# EAGLE board nixie (EAGLE 6.2), part 1 of 2
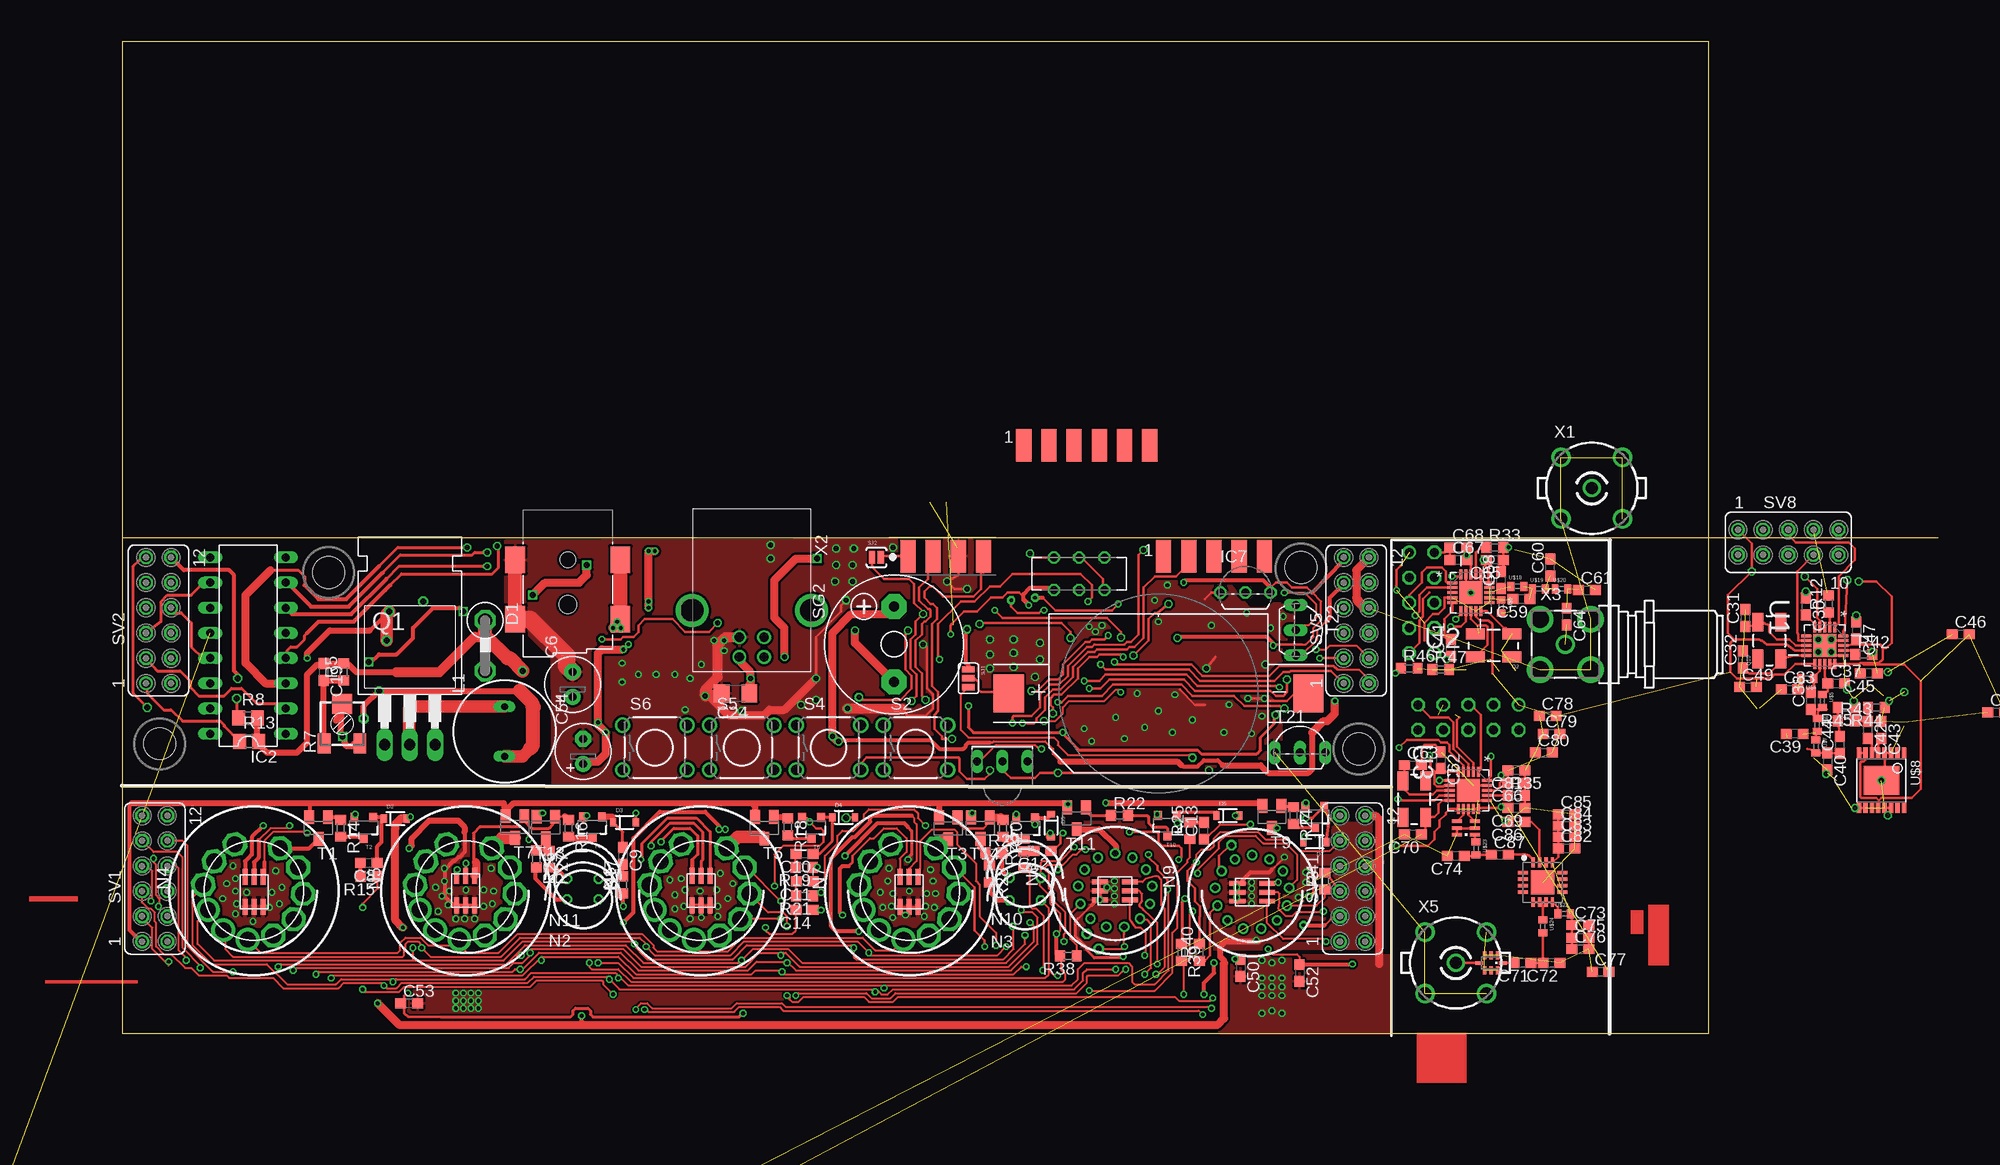
[diagram p5: board, top side]
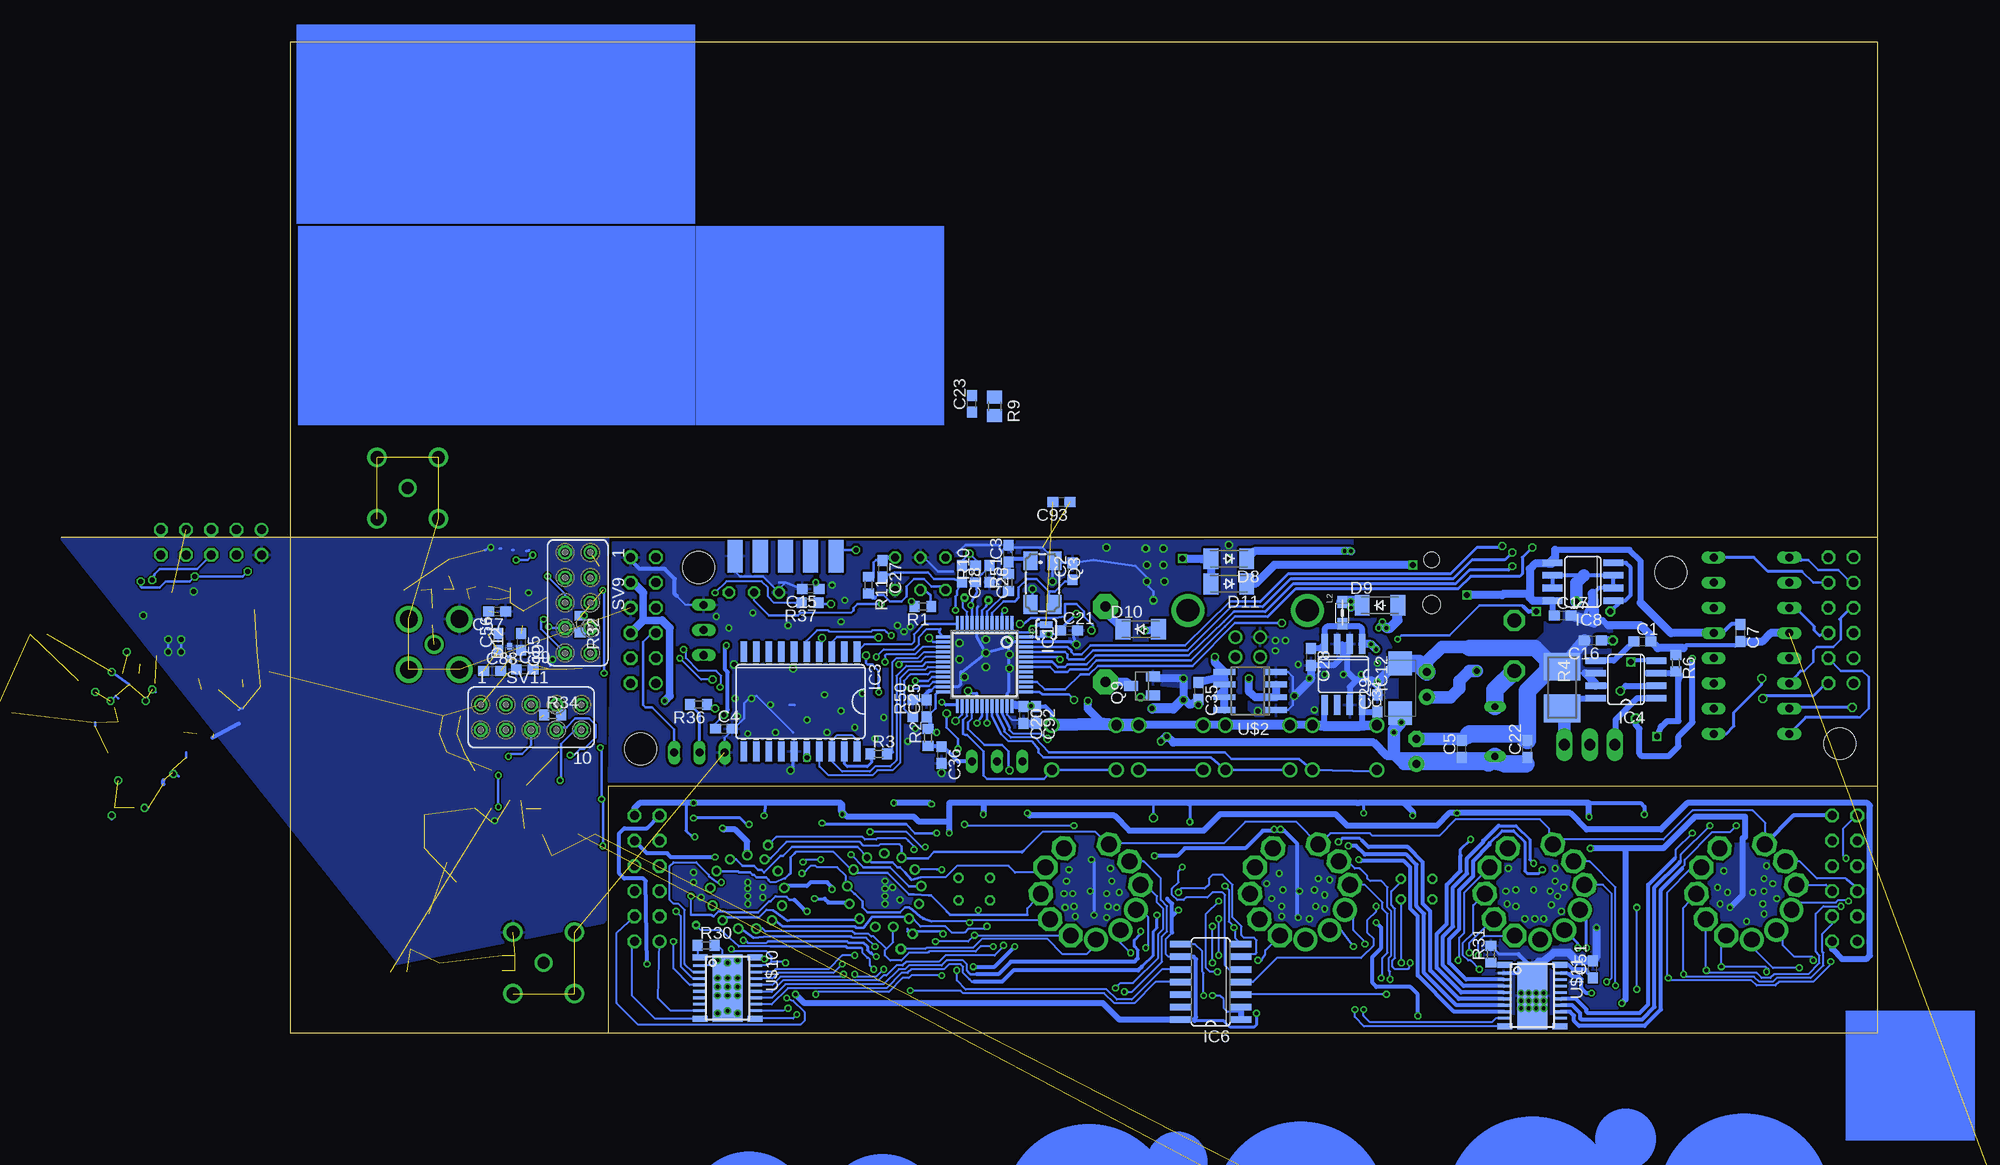
[diagram p6: board, bottom side, seen from below]

Size 183.15 x 100 mm. Coordinates in mm from the lower left corner, seen from the top.
Outline: 128.02,0 0,0 0,24.89
Outline: 128.02,0 160,0 160,100 0,100 0,50
Outline: 0,50 0,24.89
Outline: 0,50 183.15,50
Outline: 0,24.89 128.02,24.89 128.02,0
Copper layers (1*16): Top 0.035mm / dielectric 1.5mm / Bottom 0.035mm
Design rules: minimum track width 8mil, minimum drill 12mil, track to track 7mil, track to pad 7mil, pad to pad 6mil, via to via 7mil, smd to smd 0mil, copper to edge 0mil, drill to drill 10mil, minimum pad ring 8mil, minimum via ring 6mil, stop-mask expansion 2mil, vias tented up to drill 100mil, thermal gap 10mil
Holes 3.2 mm at 20.83,46.48 3.81,29.21 124.71,28.7 118.87,46.99

## Footprints (pad centres in the part's own frame; a part is rotated, then mirrored left to right if it is on the bottom)
COIN = smd 3.048 x 3.81: + -14.732,0.381; - 15.494,0.381
C0603 = smd 1.1 x 1: 1 -0.85,0; 2 0.85,0
E2,5-6 = drill 0.813 pad 1.6: + -1.27,0 | drill 0.813 pad 1.6 octagon: - 1.27,0
C1206 = smd 1.6 x 1.8: 1 -1.4,0; 2 1.4,0
SMC_C = smd 2.4 x 2.4: + -2.5,0; - 2.5,0
C1702-05 = drill 1.397 octagon: A 2.54,0; C -2.54,0
SOD-323 = smd 0.63 x 0.83: 1 -1.15,0; 2 1.15,0
SOD-123_MINI-SMA = smd 1.5 x 2.1: A 1.8,0; C -1.8,0
SOD523 = smd 0.7 x 0.5: A 0.7,0; C -0.6,0
SQFP-S-7X7-48 = smd 0.3 x 1.6: 1 -2.75,-4.1; 2 -2.25,-4.1; 3 -1.75,-4.1; 4 -1.25,-4.1; 5 -0.75,-4.1; 6 -0.25,-4.1; 7 0.25,-4.1; 8 0.75,-4.1; 9 1.25,-4.1; 10 1.75,-4.1; 11 2.25,-4.1; 12 2.75,-4.1; 25 2.75,4.1; 26 2.25,4.1; 27 1.75,4.1; 28 1.25,4.1; 29 0.75,4.1; 30 0.25,4.1; 31 -0.25,4.1; 32 -0.75,4.1; 33 -1.25,4.1; 34 -1.75,4.1; 35 -2.25,4.1; 36 -2.75,4.1 | smd 1.6 x 0.3: 13 4.1,-2.75; 14 4.1,-2.25; 15 4.1,-1.75; 16 4.1,-1.25; 17 4.1,-0.75; 18 4.1,-0.25; 19 4.1,0.25; 20 4.1,0.75; 21 4.1,1.25; 22 4.1,1.75; 23 4.1,2.25; 24 4.1,2.75; 37 -4.1,2.75; 38 -4.1,2.25; 39 -4.1,1.75; 40 -4.1,1.25; 41 -4.1,0.75; 42 -4.1,0.25; 43 -4.1,-0.25; 44 -4.1,-0.75; 45 -4.1,-1.25; 46 -4.1,-1.75; 47 -4.1,-2.25; 48 -4.1,-2.75
DIL16 = drill 0.813 long: 1 -8.89,-3.81; 2 -6.35,-3.81; 3 -3.81,-3.81; 4 -1.27,-3.81; 5 1.27,-3.81; 6 3.81,-3.81; 7 6.35,-3.81; 8 8.89,-3.81; 9 8.89,3.81; 10 6.35,3.81; 11 3.81,3.81; 12 1.27,3.81; 13 -1.27,3.81; 14 -3.81,3.81; 15 -6.35,3.81; 16 -8.89,3.81
SO20W = smd 0.66 x 2.032: 1 -5.715,-5.029; 2 -4.445,-5.029; 3 -3.175,-5.029; 4 -1.905,-5.029; 5 -0.635,-5.029; 6 0.635,-5.029; 7 1.905,-5.029; 8 3.175,-5.029; 9 4.445,-5.029; 10 5.715,-5.029; 11 5.715,5.029; 12 4.445,5.029; 13 3.175,5.029; 14 1.905,5.029; 15 0.635,5.029; 16 -0.635,5.029; 17 -1.905,5.029; 18 -3.175,5.029; 19 -4.445,5.029; 20 -5.715,5.029
SO08 = smd 0.66 x 2.032: 1 -1.905,-3.073; 2 -0.635,-3.073; 3 0.635,-3.073; 4 1.905,-3.073; 5 1.905,3.073; 6 0.635,3.073; 7 -0.635,3.073; 8 -1.905,3.073
SO14 = smd 0.66 x 2.032: 1 -3.81,-3.073; 2 -2.54,-3.073; 3 -1.27,-3.073; 4 0,-3.073; 5 1.27,-3.073; 6 2.54,-3.073; 7 3.81,-3.073; 8 3.81,3.073; 9 2.54,3.073; 10 1.27,3.073; 11 0,3.073; 12 -1.27,3.073; 13 -2.54,3.073; 14 -3.81,3.073
TO92- = drill 0.813 octagon: 1 -2.54,0; 2 0,0; 3 2.54,0
SMD_JACK = smd 2.7 x 2: 1 7,-4.8; 2 1,-4.8; 3 7,5.8; 3_1 1,5.8 | hole 1.6: 1,0.5 | hole 1.8: 5.5,0.5
BS11 = drill 0.7 long: 1 -2.5,0; 2 2.5,0
0805 = smd 1.2 x 1: 1 -1.1,0; 2 1.1,0
IN-3 = drill 0.6 octagon: A -1.587,0; K 1.587,0
IN-8 = drill 1.6 pad 2.2 octagon: 0 -4.46,-2.348; 1 1.926,-4.678; 2 4.011,-2.962; 3 5.111,-0.604; 7 -1.928,4.519; 9 -4.948,0.294; A -2.626,-4.297 | drill 1.6 pad 2.1: 4 4.636,1.915 | drill 1.6 pad 2.2: 5 3.089,3.966; 6 0.632,4.918 | drill 1.6 pad 2.1 octagon: 8 -4.008,2.862
IN-16 = drill 0.63: 0 -1.745,-3.325; 1 1.745,-3.325; 2 -2.49,2.81; 3 3.727,-0.453; 4 2.49,2.81; 5 0.898,3.645; 6 -0.898,3.645; 7 3.09,-2.133; 8 -3.727,-0.453; 9 -3.09,-2.133; A 0,-3.755; LHDP -3.511,1.331; RHDP 3.511,1.331
TO220BH = drill 1.118 long: D 0,-6.35; G -2.54,-6.35; S 2.54,-6.35
CRYSTAL-SMD-5X3 = smd 1.9 x 1.1: 1 -1.85,-1.15; 2 1.85,-1.15; 3 1.85,1.15; 4 -1.85,1.15
CTS406 = smd 1.9 x 1.4: 1 -2.2,-1.2; 2 2.2,-1.2; 3 2.2,1.2; 4 -2.2,1.2
SOT23 = smd 1 x 1.4: 1 -0.95,-1.1; 2 0.95,-1.1; 3 0,1.1
R0603 = smd 1 x 1.1: 1 -0.85,0; 2 0.85,0
SMS-WAV = smd 2.8 x 3.7: 1 2.108,0; 2 -2.108,0
RTRIM3314J = smd 1.3 x 2: 1 -1.8,-2; 3 1.8,-2 | smd 2 x 2: 2 0,2
R0805 = smd 1.3 x 1.5: 1 -0.95,0; 2 0.95,0
TACTILE-PTH = drill 1.016: 1 -3.251,2.261; 2 3.251,2.261; 3 -3.251,-2.261; 4 3.251,-2.261
F/CM12P = drill 1.016 pad 2.54 octagon: + 3.81,0; - -3.81,0
SJ_3 = smd 0.635 x 1.27: 1 -0.889,0; 2 0,0; 3 0.889,0
SJ_2S-NO = smd 0.635 x 1.27: 1 -0.45,0; 2 0.45,0
FE06-2 = drill 0.914: 1 -6.35,1.27 | drill 0.914 octagon: 2 -6.35,-1.27; 3 -3.81,1.27; 4 -3.81,-1.27; 5 -1.27,1.27; 6 -1.27,-1.27; 7 1.27,1.27; 8 1.27,-1.27; 9 3.81,1.27; 10 3.81,-1.27; 11 6.35,1.27; 12 6.35,-1.27
EDGE_10 = smd 1.524 x 3.302: 1 -7.62,-1.778; 3 -5.08,-1.778; 5 -2.54,-1.778; 7 0,-1.778; 9 2.54,-1.778 | smd 1.524 x 3.302 bottom: 2 -7.62,-1.778; 4 -5.08,-1.778; 6 -2.54,-1.778; 8 0,-1.778; 10 2.54,-1.778
EDGE_6 = smd 1.524 x 3.302: 1 -5.08,-1.778; 2 -2.54,-1.778; 3 0,-1.778; 4 2.54,-1.778; 5 5.08,-1.778; 6 7.62,-1.778
EDGE_4 = smd 1.524 x 3.302: 1 -3.81,0; 2 -1.27,0; 3 1.27,0; 4 3.81,0
FE05-2 = drill 0.914: 1 -5.08,1.27 | drill 0.914 octagon: 2 -5.08,-1.27; 3 -2.54,1.27; 4 -2.54,-1.27; 5 0,1.27; 6 0,-1.27; 7 2.54,1.27; 8 2.54,-1.27; 9 5.08,1.27; 10 5.08,-1.27
SOT23-BEC = smd 1 x 1.4: B -0.95,-1.1; C 0,1.1; E 0.95,-1.1
SOT23-3 = smd 0.8 x 0.9: 1 -0.95,-1; 2 0.95,-1; 3 0,1.1
TO92-EBC = drill 0.813 long: B 0,-1.27; C 2.54,-1.27; E -2.54,-1.27
QFN50P400X400X90-21N = smd 1.016 x 0.305: 1 -1.854,0.991; 2 -1.854,0.508; 3 -1.854,0; 4 -1.854,-0.508; 5 -1.854,-0.991; 11 1.854,-0.991; 12 1.854,-0.508; 13 1.854,0; 14 1.854,0.508; 15 1.854,0.991 | smd 0.305 x 1.016: 6 -0.991,-1.854; 7 -0.508,-1.854; 8 0,-1.854; 9 0.508,-1.854; 10 0.991,-1.854; 16 0.991,1.854; 17 0.508,1.854; 18 0,1.854; 19 -0.508,1.854; 20 -0.991,1.854 | smd 2.311 x 2.311: 21 0,0
IRREC = drill 0.8 long: 1 -2.54,0; 2 0,0; 3 2.54,0
SO-08 = smd 0.6 x 2.2: 1 -1.905,-2.6; 2 -0.635,-2.6; 3 0.635,-2.6; 4 1.905,-2.6; 5 1.905,2.6; 6 0.635,2.6; 7 -0.635,2.6; 8 -1.905,2.6
DPDTSLIDE = drill 0.8 octagon: 1A -2.54,0; 1B 2.54,0; 1X 0,0; 2A -2.54,3.3; 2B 2.54,3.3; 2X 0,3.3
C0402 = smd 0.7 x 0.9: 1 -0.65,0; 2 0.65,0
TSSOP16EXP = smd 0.45 x 1.05: 1 -2.275,-2.768; 2 -1.625,-2.768; 3 -0.975,-2.768; 4 -0.325,-2.768; 5 0.325,-2.768; 6 0.975,-2.768; 7 1.625,-2.768; 8 2.275,-2.768; 9 2.275,2.768; 10 1.625,2.768; 11 0.975,2.768; 12 0.325,2.768; 13 -0.325,2.768; 14 -0.975,2.768; 15 -1.625,2.768; 16 -2.275,2.768 | smd 3.58 x 2.94: EXP 0,0
HTSSOP20PWP = smd 0.61 x 1.5: 1 -3.095,-2.76; 10 3.095,-2.76; 11 3.095,2.76; 20 -3.095,2.76 | smd 0.27 x 1.2: 2 -2.275,-2.9; 3 -1.625,-2.9; 4 -0.975,-2.9; 5 -0.325,-2.9; 6 0.325,-2.9; 7 0.975,-2.9; 8 1.625,-2.9; 9 2.275,-2.9; 12 2.275,2.9; 13 1.625,2.9; 14 0.975,2.9; 15 0.325,2.9; 16 -0.325,2.9; 17 -0.975,2.9; 18 -1.625,2.9; 19 -2.275,2.9 | smd 6.8 x 3: EXP 0,0
PLCC6 = smd 1.6 x 0.5: 1 -1.3,0.5; 2 -1.3,-0.4; 3 -1.3,-1.3; 4 1.7,-1.3; 5 1.7,-0.4; 6 1.7,0.5
LFCSP_VQ_16 = smd 1 x 0.35: 1 2,0.975; 2 2,0.325; 3 2,-0.325; 4 2,-0.975; 9 -2,-0.975; 10 -2,-0.325; 11 -2,0.325; 12 -2,0.975 | smd 0.35 x 1: 5 0.975,-2; 6 0.325,-2; 7 -0.325,-2; 8 -0.975,-2; 13 -0.975,2; 14 -0.325,2; 15 0.325,2; 16 0.975,2 | smd 2.4 x 2.4: P$1 0,0
B35N61 = drill 1.2: 1 0,0 | drill 1.3: 2 3.099,3.099; 3 -3.099,3.099; 4 -3.099,-3.099; 5 3.099,-3.099
85-32004-10X = drill 0.92 pad 1.27: 1 4.71,-1.25; 2 4.71,1.25; 3 2.71,1.25; 4 2.71,-1.25 | drill 2.3 pad 3: M1 0,6.02; M2 0,-6.02
BU-SMA-G = drill 1.27: 1 0,0 | drill 1.778: 2 -2.55,2.55; 3 2.55,2.55; 4 2.55,-2.55; 5 -2.55,-2.55
LFL21_TC = smd 0.35 x 0.8: 1 -0.65,0.75; 2 0,0.75; 3 0.65,0.75; 5 0.65,-0.75; 6 0,-0.75; 7 -0.65,-0.75 | smd 0.8 x 0.35: 4 1.2,0; 8 -1.2,0
0896BM15A0001 = smd 0.35 x 1: 1 0.65,0.9; 2 0,0.9; 3 -0.7,0.9; 4 -0.7,-0.9; 5 0,-0.9; 6 0.65,-0.9

## Placement (x,y rotation side)
BAT1  [COIN]  104.14,33.91 0 top
C1  [C0603]  23.7,39.55 0 bottom
C2  [C0603]  81.15,46.61 90 bottom
C3  [C0603]  87.63,48.39 90 bottom
C4  [C0603]  116.33,30.73 0 bottom
C5  [C0603]  41.91,28.7 90 bottom
C6  [E2,5-6]  45.43,35.21 90 top
C7  [C0603]  13.84,40.39 270 bottom
C8  [C0603]  24.89,17.19 180 top
C9  [C0603]  50.5,17.91 270 top
C10  [C0603]  68.83,18.11 180 top
C11  [C0603]  68.84,15.32 180 top
C12  [C0603]  92.84,18.41 180 top
C13  [C0603]  109.09,20.45 90 top
C14  [C0603]  68.82,12.45 180 top
C15  [C0603]  107.57,44.83 180 bottom
C16  [C0603]  28.7,39.62 180 bottom
C17  [C0603]  31.75,42.16 0 bottom
C18  [C0603]  92.33,46.35 270 bottom
C19  [C0603]  20.32,36.45 270 top
C20  [C0603]  86.11,32.13 270 bottom
C21  [C0603]  81.53,40.64 0 bottom
C22  [C0603]  35.31,28.7 90 bottom
C23  [C0603]  91.31,63.5 90 bottom
C24  [C1206]  61.85,34.29 180 top
C25  [C0603]  95.89,32.77 90 bottom
C26  [C0603]  89.53,46.35 270 bottom
C27  [C0603]  100.33,46.86 270 bottom
C28  [C0603]  57.15,37.97 270 bottom
C29  [C0603]  50.42,33.27 90 bottom
C30  [C0603]  169.8,43.05 270 top
C31  [C0603]  163.7,41.91 90 top
C32  [C0603]  163.45,37.72 90 top
C33  [C0603]  168.15,34.67 0 top
C34  [SMC_C]  48.13,34.8 90 bottom
C35  [C0603]  68.45,34.54 270 bottom
C36  [C0603]  94.36,28.07 270 bottom
C37  [C0603]  172.85,35.31 0 top
C38  [C0603]  170.31,33.53 90 top
C39  [C0603]  168.66,30.23 180 top
C40  [C0603]  171.96,27.43 270 top
C41  [C0603]  133.99,38.86 90 top
C42  [C0603]  176.02,30.61 270 top
C43  [C0603]  177.42,30.61 270 top
C44  [C0603]  173.23,29.08 90 top
C45  [C0603]  176.15,36.32 180 top
C46  [C0603]  185.42,40.26 0 top
C47  [C0603]  174.88,40.64 270 top
C48  [C0603]  188.98,32.38 0 top  (outside the outline)
C49  [C0603]  163.96,34.92 0 top
C50  [C0603]  112.78,6.6 270 top
C51  [C0603]  28.7,6.48 90 bottom
C52  [C0603]  118.75,6.1 270 top
C53  [C0603]  28.96,3.05 0 top
C54  [E2,5-6]  46.48,28.45 90 top
C55  [C0603]  136.78,39.5 270 bottom
C56  [C0603]  139.06,39.5 90 bottom
C57  [C0603]  139.19,42.55 180 bottom
C58  [C0603]  139.06,45.72 90 top
C59  [C0603]  141.1,43.81 180 top
C60  [C0603]  144.02,46.99 90 top
C61  [C0603]  147.7,44.7 0 top
C62  [C0603]  132.97,27.56 270 top
C63  [C0603]  130.18,27.05 0 top
C64  [C0603]  145.67,42.04 270 top
C65  [C0603]  138.43,47.75 180 top
C66  [C0603]  140.59,25.27 180 top
C67  [C0603]  134.75,47.75 0 top
C68  [C0603]  134.75,49.02 0 top
C69  [C0603]  140.59,22.73 180 top
C70  [C0603]  130.18,20.07 180 top
C71  [C0603]  141.22,7.11 180 top
C72  [C0603]  144.15,7.11 180 top
C73  [C0603]  147.07,10.92 0 top
C74  [C0603]  134.49,17.91 180 top
C75  [C0603]  147.07,9.65 0 top
C76  [C0603]  147.07,8.51 0 top
C77  [C0603]  149.1,6.22 0 top
C78  [C0603]  143.76,32 0 top
C79  [C0603]  144.15,30.23 0 top
C80  [C0603]  143.38,28.32 0 top
C81  [C0603]  140.59,26.54 180 top
C82  [C0603]  145.67,18.67 0 top
C83  [C0603]  145.67,19.81 0 top
C84  [C0603]  145.67,20.95 0 top
C85  [C0603]  145.67,22.1 0 top
C86  [C0603]  140.59,21.34 180 top
C87  [C0603]  138.94,18.03 0 top
C88  [C0603]  139.7,36.58 0 bottom
C89  [C0603]  136.4,36.7 0 bottom
C90  [C0603]  -44.45,-73.66 0 top  (outside the outline)
C91  [C0603]  -44.45,-77.72 0 top  (outside the outline)
C92  [C0603]  84.84,32.13 270 bottom
C93  [C0603]  82.3,53.59 180 bottom
D1  1N5059  [C1702-05]  36.62,39.1 270 top
D2  CGRM4001-G  [SOD-323]  27.56,21.67 0 top
D3  CGRM4001-G  [SOD-323]  50.67,21.29 0 top
D4  CGRM4001-G  [SOD-323]  72.77,21.8 0 top
D5  CGRM4001-G  [SOD-323]  93.68,20.95 270 top
D6  CGRM4001-G  [SOD-323]  111.51,21.97 0 top
D7  CGRM4001-G  [SOD-323]  120.27,19.3 180 top
D8  CGRM4001-G  [SOD-123_MINI-SMA]  65.41,47.88 180 bottom
D9  CGRM4001-G  [SOD-123_MINI-SMA]  50.16,43.18 0 bottom
D10  CGRM4001-G  [SOD-123_MINI-SMA]  74.3,40.77 0 bottom
D11  CGRM4001-G  [SOD-123_MINI-SMA]  65.41,45.34 180 bottom
D12  BB141  [SOD523]  137.92,38.35 90 bottom
D13  BB141  [SOD523]  -44.45,-68.83 0 top  (outside the outline)
IC1  STM32F100CXC  [SQFP-S-7X7-48]  90.04,37.21 180 bottom
IC2  74141N  [DIL16]  12.7,39.12 90 top
IC3  DS3234  [SO20W]  108.61,33.46 180 bottom
IC4  MAX1771  [SO08]  25.36,35.7 90 bottom
IC6  74HCT164D  [SO14]  67.23,5.19 90 bottom
IC7  DS18B20  [TO92-]  113.28,44.45 0 top
IC8  MAX603  [SO08]  29.7,45.56 90 bottom
IC12  MAX603  [SO08]  53.85,36.2 180 bottom
J2  [SMD_JACK]  44.45,48.77 270 top
L1  [BS11]  38.57,30.45 90 top
L2  [0805]  53.98,42.42 270 bottom
N2  IN-3  [IN-3]  46.48,13.51 0 top
N3  IN-3  [IN-3]  91.06,13.41 0 top
N4  IN-8  [IN-8]  13.3,14.38 180 top
N5  IN-8  [IN-8]  34.66,14.38 180 top
N6  IN-8  [IN-8]  58.32,14.38 180 top
N7  IN-8  [IN-8]  79.42,14.38 180 top
N8  IN-16  [IN-16]  100.15,14.4 180 top
N9  IN-16  [IN-16]  113.96,14.22 180 top
N10  IN-3  [IN-3]  91.06,15.7 0 top
N11  IN-3  [IN-3]  46.48,15.57 0 top
Q1  BUZ11BH  [TO220BH]  29.02,35.47 0 top
Q2  [CRYSTAL-SMD-5X3]  138.3,39.12 180 top
Q3  [CTS406]  84.2,45.47 270 bottom
Q4  [CRYSTAL-SMD-5X3]  130.3,23.62 90 top
Q9  BSS123  [SOT23]  74.17,35.05 90 bottom
Q10  [CRYSTAL-SMD-5X3]  166.12,39.62 90 top
R1  [R0603]  96.27,43.05 180 bottom
R2  [R0603]  95.76,29.84 90 bottom
R3  [R0603]  100.71,28.19 0 bottom
R4  [SMS-WAV]  31.81,34.88 270 bottom
R5  [R0603]  22.35,36.45 90 top
R6  [R0603]  20.32,37.34 270 bottom
R7  [RTRIM3314J]  22.19,31.24 0 top
R8  [R0805]  12.7,31.81 0 top
R9  [R0805]  89.03,63.25 270 bottom
R10  100K  [R0603]  90.93,46.35 90 bottom
R11  100K  [R0603]  101.73,45.21 270 bottom
R12  [R0603]  172.09,43.31 90 top
R13  [R0805]  12.83,29.46 0 top
R14  [R0603]  22.05,20.7 270 top
R15  [R0603]  24.89,15.83 180 top
R16  [R0603]  45.04,20.7 270 top
R17  [R0603]  50.5,14.99 90 top
R18  [R0603]  67.14,20.83 270 top
R19  [R0603]  68.79,16.76 180 top
R20  [R0603]  88.85,20.7 270 top
R21  [R0603]  68.83,13.89 180 top
R22  [R0603]  100.58,21.97 0 top
R23  [R0603]  90.93,17.53 90 top
R24  [R0603]  118.11,21.97 270 top
R25  [R0603]  107.7,20.45 90 top
R26  [R0603]  41.78,17.61 270 top
R27  [R0603]  43.05,17.57 270 top
R28  [R0603]  87.46,16.08 270 top
R29  [R0603]  87.93,18.22 0 top
R30  [R0603]  118.11,8.89 0 bottom
R31  [R0603]  38.97,7.99 90 bottom
R32  [R0603]  130.81,41.27 270 bottom
R33  [R0603]  138.43,49.02 0 top
R34  [R0603]  133.6,32.13 0 bottom
R35  [R0603]  140.59,24 0 top
R36  [R0603]  118.87,33.16 180 bottom
R37  [R0603]  107.65,43.43 180 bottom
R38  [R0603]  95.42,7.81 180 top
R39  [R0603]  106.82,8.19 270 top
R40  [R0603]  108.65,8.19 90 top
R41  [R0603]  121.28,15.37 90 top
R42  [R0603]  175.64,38.23 0 top
R43  [R0603]  173.86,31.5 0 top
R44  [R0603]  176.91,32.89 180 top
R45  [R0603]  173.86,32.89 180 top
R46  [R0603]  129.79,36.83 0 top
R47  [R0603]  132.97,36.7 0 top
R48  [R0603]  -44.45,-81.79 0 top  (outside the outline)
R49  [R0603]  -44.45,-85.85 0 top  (outside the outline)
R50  [R0603]  97.28,32.77 90 bottom
R51  [R0603]  87.63,45.47 90 bottom
S2  [TACTILE-PTH]  80.01,28.83 0 top
S4  [TACTILE-PTH]  71.25,28.83 0 top
S5  [TACTILE-PTH]  62.48,28.83 0 top
S6  [TACTILE-PTH]  53.72,28.83 0 top
SG2  F/CM12P  [F/CM12P]  77.85,39.24 90 top
SJ1  [SJ_3]  85.34,35.81 270 top
SJ2  SOLDERJUMPERNO  [SJ_2S-NO]  76.07,48.01 0 top
SJ3  SOLDERJUMPERNO  [SJ_2S-NO]  83.82,40.77 90 bottom
SV1  [FE06-2]  3.3,15.62 90 top
SV2  [FE06-2]  3.68,41.66 90 top
SV3  [FE06-2]  124.08,15.62 90 top
SV4  [EDGE_10]  112.65,49.91 0 top
SV5  [FE06-2]  124.46,41.66 90 top
SV6  [EDGE_6]  96.01,61.09 0 top
SV7  [EDGE_4]  83.06,48.13 0 top
SV8  [FE05-2]  168.02,49.53 0 top
SV9  [FE05-2]  131.06,43.43 270 bottom
SV11  [FE05-2]  135.76,31.88 0 bottom
T1  [SOT23-BEC]  19.81,20.72 180 top
T2  [SOT23-3]  24.38,20.78 180 top
T3  [SOT23-BEC]  83.31,20.68 180 top
T4  [SOT23-3]  47.43,20.84 180 top
T5  [SOT23-BEC]  64.77,20.75 180 top
T6  [SOT23-3]  69.53,20.78 180 top
T7  [SOT23-BEC]  39.62,20.81 180 top
T8  [SOT23-3]  91.12,20.72 180 top
T9  [SOT23-BEC]  115.95,21.83 180 top
T10  [SOT23-3]  105.41,21 180 top
T11  [SOT23-BEC]  96.27,21.7 180 top
T12  [SOT23-3]  120.27,21.89 180 top
T13  [SOT23-BEC]  42.74,20.76 180 top
T14  [SOT23-BEC]  86.55,20.7 180 top
T21  [TO92-EBC]  118.79,29.59 0 top
T22  [TO92-EBC]  119.63,40.69 270 top
U1  CC1101RTK  [QFN50P400X400X90-21N]  171.7,39.12 270 top
U2  CC1101RTK  [QFN50P400X400X90-21N]  136.02,44.45 0 top
U3  CC1101RTK  [QFN50P400X400X90-21N]  135.76,24.51 270 top
U$1  IRREC  [IRREC]  88.77,27.43 0 top
U$2  TPS2010A  [SO-08]  63.25,34.54 90 bottom
U$3  DPDTSLIDE  [DPDTSLIDE]  96.52,48.01 180 top
U$4  [C0402]  169.93,35.81 180 top
U$5  [C0402]  171.45,33.53 270 top
U$6  [C0402]  170.94,31.11 270 top
U$7  [C0402]  170.81,28.96 270 top
U$8  AD8345  [TSSOP16EXP]  177.42,25.53 180 top
U$9  [C0402]  139.06,43.05 270 top
U$10  TLC59711  [HTSSOP20PWP]  115.95,4.57 270 bottom
U$11  TLC59711  [HTSSOP20PWP]  34.8,3.81 270 bottom
U$12  RGBLED_PLCC6  [PLCC6]  100.33,13.97 180 top
U$13  RGBLED_PLCC6  [PLCC6]  79.76,14.48 270 top
U$14  RGBLED_PLCC6  [PLCC6]  114.17,13.84 180 top
U$15  RGBLED_PLCC6  [PLCC6]  58.8,14.61 270 top
U$16  RGBLED_PLCC6  [PLCC6]  35.05,14.61 270 top
U$17  RGBLED_PLCC6  [PLCC6]  13.72,14.48 270 top
U$18  [C0402]  140.72,45.09 0 top
U$19  [C0402]  142.88,44.83 0 top
U$20  [C0402]  145.16,44.83 0 top
U$21  ADL5605  [LFCSP_VQ_16]  143.26,15.24 90 top
U$22  [C0402]  145.41,12.06 0 top
U$23  [C0402]  136.53,18.67 270 top
U$24  [C0402]  143.26,10.79 270 top
X1  BN35N61  [B35N61]  148.21,54.99 0 top
X2  MINI-USB_4P-85-32004-10X  [85-32004-10X]  63.5,42.67 270 top
X3  BU-SMA-G  [BU-SMA-G]  145.54,39.24 0 top
X4  BU-SMA-G  [BU-SMA-G]  -29.97,-59.94 0 top  (outside the outline)
X5  BN35N61  [B35N61]  134.49,7.11 0 top
X6  LFL21902MTC1A018  [LFL21_TC]  138.05,7.11 180 top
X7  0896BM15A0001  [0896BM15A0001]  135.51,20.7 270 top

## Tracks (layer width: path | path; a pad name or v marks a point on that pad's centre or on a via)
1HZ  (via drill 0.38, 0.5 pad 0.81)
  Top 0.254: v91.69,34.54 92.33,34.54 93.47,35.69 94.36,35.69 94.87,36.2 94.87,37.21 97.16,39.5 97.54,39.5 97.79,39.75 99.06,39.75 v99.44,40.13
  Bottom 0.203: 107.98,39.59 106.93,40.64 105.79,40.64 105.66,40.51 101.47,40.51 101.35,40.64 100.08,40.64 99.95,40.51
  Bottom 0.254: 107.98,39.59 IC3.5 | 90.81,34.29 91.19,34.29 v91.69,34.54 | v99.44,40.13 99.57,40.13 99.95,40.51
  Bottom 0.305: 90.81,34.29 90.81,33.12 IC1.29
32KHZ  (via drill 0.38, 0.5 pad 0.81)
  Top 0.254: v88.01,42.67 88.77,41.91 99.31,41.91 100.71,40.51 v100.71,39.95
  Bottom 0.254: IC1.3 88.29,42.39 v88.01,42.67 | IC3.3 105.44,39.47 104.9,40.01 100.76,40.01 v100.71,39.95
+3V3  (via drill 0.38, 0.5 pad 0.81)
  Top 0.203: 119,39.24 119.38,39.24 120.14,40.01 120.14,40.89 120.9,41.66 120.9,43.56 | 91.44,43.43 v91.44,43.18
  Top 0.254: 119,39.24 116.2,39.24 v116.08,39.12 | v116.33,32.13 116.08,32 | 115.82,44.7 IC7.3 115.82,44.96 116.33,45.47 117.47,45.47 117.98,44.96 119.51,44.96 120.02,44.45 120.9,43.56 | v79.63,33.53 80.14,34.04 80.14,36.2 79.5,36.83 79.5,39.75 80.01,40.26 80.01,41.53 v80.77,42.29 80.77,42.55 79.88,43.43 79.88,45.34 79.38,45.85 76.83,45.85 75.62,47.06 SJ2.1 | 91.44,43.43 90.42,44.45 89.28,44.45 88.77,43.94 87.63,43.94 86.23,42.55 84.9,42.55 83.65,41.3 83.65,41.23 83.57,41.15 v83.57,40.26
  Top 0.305: v116.33,32.13 116.2,32 116.2,31.24 114.81,29.84 114.81,28.57 114.43,28.19 108.84,28.19 108.46,28.57 96.52,28.57 94.87,30.23 v94.87,30.35 85.85,30.35 85.34,30.86 v85.34,33.02
  Top 0.406: v91.44,43.18 90.89,43.73 90.89,44.28 91.57,44.96 93.34,44.96 93.6,44.71 U$3.2B | SV5.11 123.19,47.75 120.02,44.45 | v116.08,39.12 116.08,39.37 115.44,40.01 106.55,40.01 v106.43,39.88 | v107.06,45.47 107.06,45.59 107.19,45.72 115.06,45.72 115.82,44.96
  Bottom 0.203: 91.31,42.93 91.31,43.05 v91.44,43.18 | v94.87,30.35 95.5,30.44 R2.2 | 101.81,44.36 R11.2 | 100.84,44.2 101.09,43.94
  Bottom 0.254: 106.62,38.58 IC3.4 106.81,38.59 106.81,39.12 106.43,39.5 v106.43,39.88 | 91.31,42.93 91.31,41.33 IC1.9 | 116.46,31.88 116.46,32.13 v116.33,32.13 117.28,31.18 C4.1 | IC1.24 94.7,34.46 95,34.16 95,32.77 95.5,32.26 95.8,32.26 C25.1 | 85.19,39.96 84.12,39.96 v83.57,40.26 83.44,40.24 82.89,40.28 82.63,40.41 C21.1 | v91.44,43.18 91.31,43.31 91.31,43.69 90.78,44.48 90.81,44.5 R10.1 90.68,45.89 90.3,46.35 89.41,47.12 C26.1 | 100.84,44.2 100.2,44.2 99.57,43.56 98.42,43.56 97.92,44.07 97.92,45.09 97.16,45.85 96.14,45.85 95.38,45.09 94.36,45.09 U$3.2B | IC1.36 | 86.07,33.02 C20.1
  Bottom 0.305: 85.19,39.96 IC1.48 | C21.1 81.59,41.59 v80.77,42.29 | IC1.36 87.03,33.11 87,33.15 | 116.46,32.13 115.95,32.64
  Bottom 0.406: C25.1 95.92,32.3 95.5,31.88 95.5,30.44 95.5,30.39 R2.2 | v83.57,40.26 83.76,40.13 SJ3.1 | C92.1 83.91,32.98 83.31,32.38 83.31,31.14 S2.2 | 115.95,32.64 115.95,36.45 116.2,36.7 116.2,38.99 v116.08,39.12 | 101.09,43.94 101.31,43.94 R11.2 | C15.1 106.72,45.12 v107.06,45.47
  Bottom 0.61: 51.94,32.51 51.94,31.34 52.32,30.96 | 51.94,32.51 IC12.8 | 55.75,30.96 IC12.5 | C29.1 51.85,32.42 51.94,32.51
  Bottom 0.813: S4.2 S4.1 S5.2 | v79.63,33.53 79.63,32.74 78.11,31.22 | S6.2 S5.1 | 87,33.15 86.27,33.15 C20.1 | 86.07,33.02 v85.34,33.02 84.88,33.02 C92.1
  Bottom 1.016: S6.1 52.32,30.96 55.75,30.96 S6.2 | S5.1 S5.2
  Bottom 1.27: S4.2 S2.1 78.11,31.22 S2.2
+5V  (via drill 0.6)
  Top 0.813: v46.86,47.24 46.86,46.23 46.1,45.47 42.67,45.47 v41.4,44.2
  Bottom 0.406: 17.27,40.39 IC2.5 15.62,40.39 14.73,41.27 13.9,41.27 C7.1 | IC8.5 32.81,47.5
  Bottom 0.61: IC8.8 32.78,42.3 C17.1 | 32.51,48.77 25.02,48.77 23.88,47.62 23.88,43.43
  Bottom 0.813: 17.27,40.39 20.83,40.39 23.88,43.43 | IC8.8 34.76,43.65 35.05,43.94 35.05,44.2 | 35.05,44.2 35.05,46.86 34.54,47.37 33.15,47.37 | 33.15,47.37 32.51,48.01 32.51,48.77 | 33.15,47.37 32.87,47.37 IC8.5 | D11.C 62.74,45.34 60.83,47.24 v46.86,47.24 | v41.4,44.2 37.85,44.2 37.72,44.32 35.18,44.32 35.05,44.2
+5V/4  (via drill 0.38)
  Top 0.203: U$13.4 U$13.5 U$13.6 | 115.95,16.51 v117.22,17.78 | 96.39,11.56 97.79,12.95 | 58.42,12.89 58.42,12.95 57.55,12.95 U$15.4 | U$15.5 U$15.6 | U$12.5 U$12.4
  Top 0.254: U$12.6 v98.56,13.47 v98.55,13.46
  Top 0.305: 96.39,11.56 96.14,11.3 96.14,9.78 97.28,8.64 97.28,8.38 98.04,7.62 100.84,7.62 v100.97,7.75 | U$13.4 78.46,12.48 v78.99,11.94 | v79.25,17.53 79.25,17.65 79.63,18.03 79.63,20.45 79.25,20.83
  Top 0.406: U$16.6 U$16.5 U$16.4 33.45,12.9 32.51,13.84 32.51,16.51 33.4,17.4 33.53,17.4 33.91,17.78 34.04,17.78 34.54,18.29 34.54,20.32 | U$14.4 112.68,15.14 113.79,16.26 115.7,16.26 115.95,16.51 | U$12.5 98.63,13.79 97.79,12.95 | 79.25,20.83 78.87,21.21 76.2,21.21 v72.9,17.91 | v58.42,11.68 58.42,12.89 U$15.5 | v60.83,20.57 v60.2,20.57 60.2,20.95 58.8,22.35 54.23,22.35 51.56,19.68 51.56,12.19 v50.55,11.18 | v46.35,1.78 46.35,1.02 46.48,0.89
  Top 0.61: 34.54,20.32 34.54,20.83 33.91,21.46 30.99,21.46 29.21,19.68 29.21,18.92 v28.96,18.67 | v14.86,12.7 14.29,12.7 U$17.6 | 111.12,7.11 111.12,7.37 110.74,7.75 110.74,8.76 111.25,9.27 114.55,9.27 v114.37,9.4
  Top 0.813: v25.78,3.05 27.94,0.89 46.48,0.89 110.49,0.89 111.12,1.52 111.12,7.11
  Bottom 0.203: 114.05,9.27 113.92,9.14 112.01,9.14 111.89,9.27
  Bottom 0.254: 101.85,8.76 102.23,9.14 103.76,9.14 103.89,9.27 111.89,9.27 | 114.55,9.27 114.05,9.27
  Bottom 0.305: v100.97,7.75 101.09,7.75 101.47,8.13 101.6,8.13 101.85,8.38 101.85,8.76 | v114.37,9.4 114.55,9.27 | v78.99,11.94 78.99,17.27 v79.25,17.53
  Bottom 0.406: v117.22,17.78 121.67,17.78 122.05,18.16 124.08,18.16 SV3.10 | v72.9,17.91 70.61,17.91 69.85,18.67 63.75,18.67 61.98,20.45 60.07,20.45 | v58.42,11.68 58.55,11.81 58.55,19.18 59.82,20.45 60.07,20.45 | v60.2,20.57 60.07,20.45 | v50.55,11.18 50.04,10.67 50.04,8.64 50.93,7.75 50.93,5.08 50.55,4.7 47.12,4.7 46.35,3.94 v46.35,1.78
  Bottom 0.61: 25.4,18.67 21.59,18.67 18.41,21.84 13.34,21.84 13.34,19.81 13.59,19.68 13.59,13.97 v14.86,12.7 | 25.4,18.67 v28.96,18.67 | 25.4,18.67 25.4,3.43 v25.78,3.05
  other vias: 15.49,16.38 16.13,14.73 15.88,13.08 13.21,11.3 12.57,14.22 11.18,16.89 10.54,15.11 11.43,14.35 11.43,15.62 11.56,13.08 11.43,12.06 15.11,14.22 10.16,13.59 37.21,16.64 36.45,14.48 34.67,14.48 33.02,14.35 32.89,12.95 33.66,11.56 34.54,11.56 35.56,11.56 36.45,12.83 37.47,14.35 32.26,13.84 32.51,15.37 31.62,14.73 32.51,16.64 31.88,12.32 37.34,13.08 58.29,14.35 56.77,14.48 59.94,14.48 60.07,12.83 56.64,12.83 57.28,11.56 60.07,11.81 61.59,15.11 60.33,16.13 56.39,15.62 55.75,13.97 55.75,12.57 61.09,13.59 79.38,14.35 77.6,12.83 81.03,12.83 81.15,14.1 77.72,14.1 77.72,11.68 80.9,11.81 81.53,16.51 82.04,14.1 81.92,12.7 76.71,12.7 76.45,14.22 77.34,16.64 77.22,15.37 81.79,15.37 55.24,15.49 100.08,15.37 100.08,14.61 100.08,13.84 100.08,13.08 112.39,14.73 112.39,13.72 113.92,15.24 113.92,14.61 113.92,13.84 113.92,13.08 119.38,16.26 118.62,13.72 99.31,14.73 119.38,15.24
  pour Top (isolate 0.229): 112.14,20.19 120.78,20.19 122.94,21.21 127.38,21.21 127.89,8.51 92.33,8.38 92.33,17.78 95.89,21.34 110.11,21.34
  pour Top (isolate 0.254): 36.58,9.78 36.83,9.78 39.62,12.57 39.62,16.76 37.34,19.05 32.77,19.05 29.72,16 29.72,12.32 31.88,10.16
  pour Top (isolate 0.254): 14.73,9.91 14.99,9.91 17.78,12.7 17.78,16.89 15.49,19.18 10.92,19.18 7.87,16.13 7.87,12.45 10.03,10.29
  pour Top (isolate 0.254): 60.33,9.65 60.58,9.65 63.37,12.45 63.37,16.64 61.09,18.92 56.52,18.92 53.47,15.88 53.47,12.19 55.63,10.03
  pour Top (isolate 0.254): 81.41,9.53 81.66,9.53 84.45,12.32 84.45,16.51 82.17,18.8 77.6,18.8 74.55,15.75 74.55,12.06 76.71,9.91
  pour Bottom (isolate 0.254): 14.73,9.78 14.99,9.78 17.78,12.57 17.78,16.76 15.49,19.05 10.92,19.05 7.87,16 7.87,12.32 10.03,10.16
  pour Bottom (isolate 0.254): 36.58,10.29 37.72,10.92 39.37,12.45 39.75,16.26 37.47,18.54 32.89,18.54 30.23,16 30.23,12.32 32.26,10.03
  pour Bottom (isolate 0.254): 59.94,9.53 60.2,9.53 62.99,12.32 62.99,16.51 60.71,18.8 56.13,18.8 53.09,15.75 53.09,12.06 55.24,9.91
  pour Bottom (isolate 0.254): 81.15,9.4 81.41,9.4 84.2,12.19 84.2,16.38 82.55,20.32 77.98,20.32 74.3,15.62 74.3,11.94 76.45,9.78
  pour Bottom: 99.06,17.14 119.13,17.14 122.05,17.4 122.05,11.3 117.86,10.67 98.3,10.67 96.27,12.7 96.27,14.73 97.54,16
+12V  (via drill 0.38, 0.5 pad 0.81, 0.6, 0.6 pad 1.02)
  Top 0.203: 87.76,29.34 87.88,29.46 93.09,29.46 93.85,28.7
  Top 0.254: 87.5,29.34 87.76,29.34 | 93.85,28.7 93.85,28.19 94.61,27.43 | 106.81,27.05 106.93,27.05 107.06,26.92 | v50.55,38.73 v51.05,39.24
  Top 0.406: 25.02,40.64 v26.92,42.55 | v72.26,29.46 72.39,29.59 81.53,29.59 82.42,28.7 84.84,28.7 85.09,28.96 85.09,29.08 85.34,29.34 87.5,29.34 | 107.06,26.92 108.46,26.92 109.09,27.56 110.49,27.56 111,27.05
  Top 0.61: 40.13,34.54 v25.91,34.54 24.38,33.02 v24.38,31.75 | 25.02,40.64 20.95,40.64 18.67,38.35 v18.67,37.85 | 94.61,27.43 106.43,27.43 106.81,27.05 | 111,27.05 114.81,27.05 115.57,26.29 119.63,26.29 120.02,26.67 120.02,30.35
  Top 0.813: L1.1 38.59,27.95 38.61,27.94 38.86,27.94 | SG2.+ 77.09,42.29 73.53,42.29 71.63,40.39 v71.63,29.97 72.01,29.59 v72.26,29.46 | 120.02,30.35 121.16,31.5 121.54,31.5 122.3,32.26 v122.3,33.53 | v50.55,38.73 48.39,38.73 48.01,38.35 v48.01,31.37 48.01,31.11 v48.77,30.35 48.77,28.19 48.01,27.43 47.24,27.43 46.99,27.18 C54.+
  Top 1.27: L1.1 40.4,27.95 41.15,28.7 | v26.67,39.62 26.67,42.29 v26.92,42.55
  Top 1.422: 41.15,28.7 41.4,28.96 41.4,33.02 | 41.4,33.02 41.4,33.27 40.13,34.54 | 41.4,33.02 41.53,32.89
  Bottom 0.305: 35.43,27.18 C22.1 | 39.22,27.3 C5.1
  Bottom 0.406: IC8.4 25.36,47.46 24.89,46.99 24.89,44.2 25.4,43.69 25.78,43.69 | 25.78,43.69 26.6,43.69 IC8.1 | v26.92,42.55 25.78,43.69 | 53.98,41.02 L2.2
  Bottom 0.61: IC4.2 25.39,35.06 v25.91,34.54 | v24.38,31.75 24.38,31.11 24,30.73 24,28.19 23.75,27.94 21.08,27.94 20.07,28.96 20.07,29.97 18.67,31.37 v18.67,37.85 | C28.1 56.2,38.82 IC12.4 55.75,40.77 55.5,41.02 53.98,41.02 52.2,41.02 51.94,40.77 IC12.1
  Bottom 0.762: 124.46,44.45 124.46,41.66 122.56,41.66 | 121.79,34.04 121.79,40.89
  Bottom 0.813: v26.67,39.62 C16.1 | SG2.+ 77.85,42.52 D10.C | L1.1 38.58,27.94 49.4,27.94 50.8,29.34 70.99,29.34 v71.63,29.97 71.75,29.97 v72.26,29.46 | SV5.10 125.48,45.47 124.46,44.45 | 124.46,41.66 SV5.6 | 121.79,40.89 122.56,41.66 | v122.3,33.53 121.79,34.04 | IC12.1 51.08,39.27 v50.55,38.73
  Bottom 1.27: L1.1 39.35,27.18 C54.+ 47.75,27.18 48.77,28.19 v48.77,30.35 48.77,30.61 48.13,31.24 C34.+
  Bottom 1.778: 35.43,27.18 37.59,27.18 38.37,27.45 L1.1 39.22,27.3
+24V  (via drill 0.38, 0.5)  (17 unrouted)
  Top 0.254: U1.14 U1.15 175.18,37.26 175.26,37.34 175.51,37.34 | 174.88,39.24 177.29,39.24 177.55,38.86 | 174.88,39.24 U1.18 | 177.55,38.86 177.55,37.72 177.16,37.34 175.51,37.34 | U1.11 168.71,37.26 167.64,36.2 166.62,36.2 166.24,35.81 164.97,35.81 | U1.9 168.66,38.61 167.89,39.24 165.86,39.24 165.35,39.62 165.23,39.62 165.1,39.75 162.56,39.75 | 162.56,39.75 162.18,39.37 162.18,36.45 162.81,35.81 164.97,35.81 | U1.4 171.2,41.66 170.94,41.91 170.94,44.83 v169.67,46.1 | SV8.1 164.34,49.4 v164.34,46.61 161.93,44.2 161.93,40.39 162.56,39.75 | 177.55,38.86 177.93,38.86 178.44,39.37 178.44,44.07 176.91,45.59 v175.13,45.59 | 174.88,39.24 C47.2 | 175.51,37.34 175.64,37.21 179.71,37.21 181.36,35.56 181.36,24.64 180.47,23.75 177.42,23.75 177.16,23.5 | 164.97,35.81 164.85,35.69 | U$8.8 U$8.7 175.79,27.59 175.64,27.43 175.39,27.43 175.26,27.3 175.26,23.88 175.39,23.75 176.91,23.75 177.16,23.5 | 177.16,23.5 177.16,22.83 U$8.12 | v128.52,44.7 128.52,46.74 128.91,47.12 | U2.4 133.35,43.94 133.35,42.93 132.72,42.29 132.21,42.29 131.32,41.4 131.32,39.62 | 137.45,47.59 C65.2 | U2.14 U2.15 137.79,45.52 137.79,46.74 137.45,47.08 137.45,47.59 | v137.29,47.75 137.45,47.59 | U2.18 136.02,47.71 C67.2 v135.6,48.26 C68.2 | U2.9 136.53,42.04 136.91,41.66 137.79,41.66 138.18,41.27 138.18,36.32 | U3.4 135.25,27.05 133.86,28.45 133.86,29.08 133.6,29.34 132.97,29.34 132.72,29.59 129.54,29.59 v128.78,28.83 | U3.9 132.84,24 132.33,23.5 128.78,23.5 v128.65,23.62 | U3.18 138.56,24.51 138.94,24.89 138.94,25.27 139.06,25.4 139.61,25.4 C66.2 139.74,26.04 | 139.74,26.04 C81.2 | U3.14 U3.15 136.83,22.73 C69.2 139.19,22.73 v139.06,22.86
  Top 0.254: v139.06,26.04 139.74,26.04 | U3.11 133.91,22.66 133.48,22.23 133.48,22.1 132.84,21.46 132.84,20.83 132.33,20.32 132.33,19.56 131.7,18.92 v128.52,18.92
  Bottom 0.254: v164.34,46.61 164.85,46.1 v169.67,46.1 170.18,45.59 172.59,45.59 173.23,44.96 175.01,44.96 175.13,45.09 v175.13,45.59 | v128.4,36.32 128.4,44.58 v128.52,44.7 | v137.29,47.75 136.1,47.75 v135.6,48.26 | v128.78,28.83 128.65,28.7 v128.65,23.62 128.52,23.5 v128.52,18.92 | v139.06,22.86 v139.06,26.04
ANODE0  (via drill 0.38)
  Top 0.203: v24.26,12.7 24.26,13.08 25.78,14.61 25.78,15.79 R15.1 | v24.26,4.45 24.51,4.19 27.94,4.19 28.45,4.7 41.15,4.7 41.78,5.33 48.39,5.33 48.51,5.21 48.51,4.95 v49.53,3.94
  Bottom 0.203: v24.26,4.45 v24.26,12.7 | v49.53,3.94 64.14,3.94 IC6.3
ANODE1  (via drill 0.38)
  Top 0.406: v50.55,12.83 50.55,14.09 R17.1
  Bottom 0.203: v50.55,12.83 50.55,12.32 51.44,11.43 51.44,10.16 50.8,9.53 50.8,8.89 52.07,7.62 60.56,7.62 62.99,5.19
  Bottom 0.254: 62.99,5.19 IC6.4
ANODE2  (via drill 0.38)
  Top 0.203: v70.1,16.76 R19.1
  Bottom 0.203: IC6.5 65.39,6.46 65.79,6.86 65.79,13.97 66.04,14.22 67.06,14.22 67.56,13.72 69.72,13.72 69.98,13.46 70.61,13.46 71.12,13.97 71.12,14.61 70.48,15.24 70.48,16.38 v70.1,16.76
ANODE3  (via drill 0.38)
  Top 0.203: v70.48,14.22 69.89,14.22 R21.1
  Bottom 0.203: IC6.6 63.89,8 62.74,8 62.61,8.13 62.61,9.4 62.87,9.65 63.88,9.65 64.14,9.91 64.14,10.79 65.02,11.68 65.02,14.99 66.04,16 67.06,16 67.44,15.62 67.44,14.99 67.82,14.61 70.23,14.61 v70.48,14.22
ANODE4  (via drill 0.38)
  Top 0.203: 91.57,16.38 91.57,12.83 91.82,12.57 92.2,12.57 92.96,11.81 92.96,6.48 v92.84,6.35
  Top 0.406: R23.1 91.27,16.68 91.57,16.38
  Bottom 0.203: v92.84,6.35 92.84,5.33 91.95,4.45 77.72,4.45 76.71,3.43 75.18,3.43 72.15,6.46 IC6.10
ANODE5  (via drill 0.38)
  Top 0.203: R25.1 107.7,17.78 107.44,17.53 107.44,17.27 106.43,16.26 106.43,10.67 105.92,10.16 105.92,6.1 104.14,4.32 v97.54,4.32
  Bottom 0.203: IC6.11 72.79,5.19 74.93,3.05 76.96,3.05 77.98,4.06 92.2,4.06 92.46,4.32 v97.54,4.32
BUT0
  Bottom 0.203: 84.58,28.7 85.22,29.46 87.63,29.46 88.39,30.23
  Bottom 0.254: S5.3 S5.4 67.23,27.81 84.07,27.81 84.58,28.32 84.58,28.7 | IC1.32 89.29,32.02 88.65,30.73 88.39,30.23
BUT1
  Bottom 0.203: 88.01,30.48 87.38,29.84 84.96,29.84 83.57,28.32
  Bottom 0.254: S6.3 50.6,26.59 50.86,26.61 50.9,26.44 S6.4 58.34,27.69 65.15,27.69 65.79,28.32 83.57,28.32 | IC1.33 88.79,32.15 88.01,30.73 88.01,30.48
BUT2  (via drill 0.5 pad 0.81)
  Top 0.254: S4.4 74.55,26.77 74.55,27.3 75.06,27.81 84.33,27.81 84.45,27.69 84.45,26.42 85.22,25.65 87,25.65 87.5,26.16 v87.5,26.54
  Bottom 0.203: 87.63,28.45 88.27,29.08 | 91.31,33.09 91.31,31.75 91.69,31.37
  Bottom 0.254: S4.3 S4.4 74.55,26.77 | 88.27,29.08 90.04,29.08 91.69,30.73 91.69,31.37 | 91.31,33.09 IC1.28 | 87.63,28.45 87.63,26.67 v87.5,26.54
BUT3
  Bottom 0.203: IC1.27 91.79,32.03 91.82,32
  Bottom 0.254: S2.4 83.01,26.85 | S2.4 84.05,25.65 89.79,25.65 90.17,26.04 90.17,28.45 91.82,30.1 91.95,30.1 92.2,30.23 92.2,31.62 91.82,32 | S2.3 S2.4
DIGITS0  (via drill 0.38)
  Top 0.203: 84.96,16.13 84.48,16.13 N7.0 | SV1.3 2.03,11.68 3.05,10.67 3.05,8.51 4.7,6.86 v4.7,7.24 | v91.19,6.73 90.68,6.73 89.92,5.97 66.8,5.97 v66.55,6.22 | 66.42,6.35 v66.55,6.22 | 66.42,6.35 63.88,6.35 63.5,5.97 51.82,5.97 50.04,7.75 42.29,7.75 | 66.42,6.35 66.67,6.35 v66.55,6.22 | 42.29,7.75 40.39,5.84 21.34,5.84 v21.08,5.59 | N6.0 63.03,16.73 v66.42,13.34 66.8,12.95 | 42.29,7.75 v42.29,7.37
  Top 0.254: v87,8.76 87,9.4 85.98,10.41 85.98,14.73 84.45,16.26 84.36,16.26 N7.0
  Bottom 0.203: N5.0 39.84,16.04 41.66,14.22 41.66,10.16 42.16,9.65 42.16,7.62 42.1,7.56 v42.29,7.37 | v66.55,6.22 67.31,6.22 67.69,6.6 67.69,12.06 v66.42,13.34 | 87,16.26 84.36,16.26 N7.0 | N4.0 17.86,16.64 18.8,16.64 21.21,14.22 21.21,5.71 v21.08,5.59 21.08,5.46 20.95,5.33 12.7,5.33 12.19,4.83 10.29,4.83 9.91,5.21 6.48,5.21 4.7,6.99 v4.7,7.24 | v87,8.76 87,8.51 | 87.63,16.89 92.84,16.89 93.98,15.75 96.52,15.75
  Bottom 0.254: 96.52,15.75 97.41,15.49 98.04,16.26 98.55,16.76 98.81,16.76 99.31,17.27 101.45,17.27 N8.0 101.9,17.82 102.87,18.8 109.47,18.8 110.36,17.91 110.62,17.91 112.27,16.26 112.52,16.51 112.9,16.51 113.28,16.89 114.43,16.89 115.08,17.55 N9.0 | 87,16.26 87.63,16.89
  Bottom 0.406: v91.19,6.73 89.03,6.73 v87,8.76
DIGITS1
  Bottom 0.203: N6.1 56.46,18.99 | 86.11,18.41 84.2,20.32 78.87,20.32 77.54,18.99 N7.1 77.29,19.18 65.91,19.18 63.75,21.34 58.6,21.34 N6.1 | N6.1 55.43,19.94 55.18,20.19 51.18,20.19 50.93,19.94 44.2,19.94 42.55,21.59 34.04,21.59 33.09,20.64 33.09,18.99 N5.1 32.15,19.56 21.59,19.56 18.67,22.48 12.57,22.48 11.3,21.21 11.3,19.05 N4.1 10.79,19.56 | 109.98,19.3 102.62,19.3 102.23,18.92 100.71,18.92 100.58,19.05 98.61,19.05 98.61,19.06
  Bottom 0.254: 86.3,18.29 95.12,18.29 95.76,17.65 98.34,17.65 N8.1 98.41,18.86 98.61,19.06 | 109.98,19.3 111.63,17.65 112.11,17.65 N9.1
  Bottom 0.305: 86.3,18.29 86.23,18.29 86.11,18.41
  Bottom 0.406: SV1.12 8.47,21.97 N4.1
DIGITS2  (via drill 0.38)
  Top 0.203: SV1.5 2.03,13.21 2.67,12.57 2.92,12.57 3.3,12.19 3.3,11.3 3.43,11.18 3.43,8.76 4.19,8 4.95,8 6.35,6.6 6.99,6.6 7.75,5.84 10.54,5.84 10.79,5.59 15.24,5.59 16.26,4.57 21.84,4.57 22.35,5.08 26.29,5.08 26.42,4.95 v26.42,4.83 26.67,4.57 27.69,4.57 28.19,5.08 40.89,5.08 41.53,5.71 48.9,5.71 v49.15,5.46 | 75.95,4.45 76.07,4.45 76.58,3.94 77.22,3.94 77.72,4.45 96.01,4.45 96.9,5.33 96.9,6.1 97.28,6.48 v100.2,6.48 | 75.95,4.45 v75.95,4.19 | 75.95,4.45 50.16,4.45 v49.15,5.46 | v49.15,5.46 49.02,5.71 | 102.8,11.43 103.38,11.43 103.76,11.05 103.76,6.6 v103.12,5.97
  Top 0.254: 102.8,11.43 N8.2
  Bottom 0.203: N5.2 29.03,17.34 26.42,14.73 v26.42,4.83 | N7.2 73.99,17.34 72.26,15.62 72.26,13.46 71.63,12.83 71.63,10.29 72.14,9.78 72.14,7.24 75.18,4.19 v75.95,4.19 | N4.2 7.82,17.34 6.1,15.62 3.17,15.62 3.11,15.56 | v100.2,6.48 100.97,5.71 102.87,5.71 v103.12,5.97 | v49.15,5.46 49.15,6.22 49.28,6.35 49.28,7.62 49.02,7.87 49.02,12.32 49.4,12.7 49.4,14.73 50.04,15.37 51.18,15.37 51.44,15.62 51.44,15.88 52.2,16.64 52.7,16.64 53.41,17.34 N6.2
  Bottom 0.254: 102.62,11.61 N8.2 102.64,11.53 103,11.43 109.6,11.43 109.89,11.33 111.35,12.44 112.01,12.45 112.78,11.68 116.18,11.68 N9.2 | SV1.5 2.16,14.73 3.11,15.56
DIGITS3  (via drill 0.38)
  Top 0.203: v105.41,14.54 105.16,14.35 | v105.41,14.54 105.16,14.22 | N4.3 8.36,14.97 7.11,13.72 7.11,8.89 9.02,6.99 14.61,6.99 16.64,4.95 21.59,4.95 22.1,5.46 27.43,5.46 | 27.43,5.46 27.56,5.46 v27.3,5.21 | 27.43,5.46 v27.3,5.21 | 50.16,5.71 51.05,4.83 76.83,4.83 v76.83,4.57 77.09,4.83 95.76,4.83 96.39,5.46 96.39,6.48 97.03,7.11 101.47,7.11 101.85,6.73 101.85,5.21 102.11,4.95 104.14,4.95 105.54,6.35 105.54,14.41 v105.41,14.54 | 50.04,5.84 50.16,5.71 | 50.16,5.71 v50.04,5.59 50.04,5.84 | v27.3,5.21 27.56,5.33 27.69,5.46 40.64,5.46 41.27,6.1 49.78,6.1 50.04,5.84
  Top 0.254: 105.41,14.35 v105.41,14.54 105.41,15.49 104.39,16.51 104.39,16.89 103.5,17.78 v103.5,18.03
  Bottom 0.203: N5.3 27.69,14.99 26.8,14.1 26.8,5.59 27.18,5.21 v27.3,5.21 | N6.3 51.69,14.99 49.91,13.21 49.91,12.57 49.4,12.06 49.4,8.13 49.91,7.62 49.91,5.71 v50.04,5.59 | N7.3 73.79,14.99 72.64,13.84 72.64,13.21 72.01,12.57 72.01,10.54 72.52,10.03 72.52,7.62 75.06,5.08 76.33,5.08 v76.83,4.57 | N4.3 5.21,14.99 SV1.6
  Bottom 0.254: SV1.6 5.11,14.19 | 96.43,14.95 N8.3 97.66,14.85 99.57,16.76 102.23,16.76 v103.5,18.03
  Bottom 0.406: v105.41,14.54 105.41,14.73 105.92,15.24 107.57,15.24 107.95,14.86 110.05,14.86 N9.3
DIGITS4  (via drill 0.38)
  Top 0.203: N4.4 7.62,11.32 7.62,9.02 9.27,7.37 29.34,7.37 | SV1.7 2.54,16.89 3.05,16.38 3.05,13.46 v2.92,13.34 | v89.79,10.79 89.92,10.67 89.92,8.51 88.9,7.49 74.04,7.49 73.79,7.75 v73.79,8.64 73.53,8.89 62.99,8.89 61.59,7.49 52.96,7.49 51.44,9.02 v51.69,9.02 51.31,9.27 40.39,9.27 38.48,7.37 29.34,7.37 | 29.34,7.37 v29.34,8.64
  Bottom 0.203: N4.4 7.97,13.21 4.19,13.21 3.94,13.46 3.05,13.46 v2.92,13.34 | 29.72,12.07 N5.4 | v73.79,8.64 73.53,8.76 73.53,11.68 73.79,11.94 74.26,11.94 N7.4 | v89.79,10.79 90.04,10.54 91.69,10.54 92.08,10.16 93.34,10.16 93.98,10.79 96.52,10.79 | v51.69,9.02 51.56,9.14 52.83,10.41 52.83,11.61 N6.4
  Bottom 0.254: N9.4 111.17,11.41 110.43,10.79 103.12,10.79 103,10.67 102.23,10.67 101.41,11.75 97.82,11.75 N8.4 97.16,11.43 96.52,10.79
  Bottom 0.305: v29.34,8.64 29.34,11.69 29.72,12.07
DIGITS5  (via drill 0.38)
  Top 0.203: N4.5 10.41,10.4 10.41,8.51 11.18,7.75 28.32,7.75 28.45,7.87 28.45,8.51 28.57,8.64 28.57,9.02 28.83,9.27 29.84,9.27 30.23,8.89 v30.23,8.64 31.11,7.75 38.23,7.75 40.13,9.65 52.2,9.65 52.83,9.02 v52.83,8.76 53.72,7.87 61.34,7.87 62.74,9.27 74.17,9.27 v75.31,8.13 75.31,8 75.44,7.87 88.27,7.87 v89.15,8.76 | SV1.8 5.46,16.89 5.71,16.64 5.71,8.38 6.48,7.62 v6.48,7.37
  Bottom 0.203: N6.5 54.02,10.33 v52.83,8.76 | N8.5 99.25,9.2 99.95,8.51 | 99.95,8.51 100.08,8.38 100.08,7.87 99.57,7.37 98.42,7.37 97.66,8.13 95.76,8.13 95.63,8.26 90.93,8.26 90.42,8.76 v89.15,8.76 | N9.5 112.43,10.58 112.14,10.29 103.38,10.29 103.12,10.03 101.73,10.03 101.47,9.78 101.22,9.78 99.95,8.51 | N4.5 9.53,9.6 9.53,8.89 8.38,7.75 6.6,7.75 6.48,7.62 v6.48,7.37 | N7.5 76.33,9.15 v75.31,8.13
  Bottom 0.305: v30.23,8.64 30.23,9.08 N5.5
DIGITS6  (via drill 0.38, 0.6 pad 1.02)
  Top 0.203: SV1.9 3.17,18.29 5.59,18.29 6.1,17.78 6.1,8.64 8,6.73 v7.87,6.6 | N4.6 14.01,8.13 27.81,8.13 28.07,8.38 28.07,9.14 28.57,9.65 30.1,9.65 30.86,8.89 33.15,8.89 33.15,9.02 33.41,8.75 34.02,8.75 N5.6 34.02,8.9 34.8,8.13 37.97,8.13 39.88,10.03 52.45,10.03 53.59,8.89 53.59,8.64 53.98,8.26 57.28,8.26 57.69,8.67 N6.6 57.66,9.43 57.66,8.89 58.29,8.26 61.09,8.26 62.48,9.65 74.68,9.65 75.95,8.38 77.72,8.38 78.79,9.45 N7.6 | v98.49,8.51 100.84,8.51 v101.09,8.76 101.05,8.8 101.05,9.99
  Top 0.254: 101.05,9.99 N8.6
  Bottom 0.203: N7.6 78.87,9.39 78.87,8.89 79.76,8 82.17,8 83.69,9.53 90.3,9.53 91.19,8.64 95.89,8.64 96.01,8.51 v98.49,8.51 | N4.6 12.57,9.37 12.57,8.64 10.54,6.6 v7.87,6.6 | 103.5,9.78 103.38,9.65 101.98,9.65 v101.09,8.76
  Bottom 0.254: N9.6 114.66,10.58 113.35,9.65 111.82,9.78 103.5,9.78
DIGITS7  (via drill 0.38, 0.6 pad 1.02)
  Top 0.203: v95,9.27 95,10.03 95.12,10.16 95.12,12.19 93.98,13.34 93.98,14.1 93.47,14.61 93.47,16.13 93.09,16.51 93.09,16.76 93.34,17.02 94.36,17.02 | SV1.10 6.1,19.43 6.6,18.92 6.6,8.76 9.14,6.22 v11.18,6.22 | 39.62,7.87 v40.26,7.87 | 39.62,7.87 38.73,6.99 16,6.99 v15.75,6.73 | v91.06,9.91 91.06,9.02 89.15,7.11 68.58,7.11 67.18,8.51 63.63,8.51 v62.48,7.37 62.23,7.11 52.58,7.11 50.8,8.89 40.64,8.89 39.62,7.87 | v111.89,18.99 111.7,18.99 110.62,17.91 | v97.16,18.54 96.77,18.54 96.27,18.03 95.89,18.03 94.87,17.02 94.36,17.02 | 94.36,17.02 v94.36,16.51
  Top 0.254: 110.62,17.91 110.62,16.61 N9.7
  Bottom 0.203: N7.7 81.64,9.91 v91.06,9.91 91.69,9.27 v95,9.27 | N4.7 15.57,9.53 15.88,9.27 15.75,8.89 v15.75,6.73 11.3,6.73 10.92,6.35 v11.18,6.22 | v62.48,7.37 62.1,7.37 61.72,8 61.72,8.39 N6.7 | v40.26,7.87 40.26,8.26 | 97.69,19.4 97.98,19.68 100.84,19.68 100.97,19.56 102.11,19.56 102.36,19.81 111.06,19.81 v111.89,18.99 | v40.26,7.87 40.39,8 | N5.7 39.67,9.86 40.26,9.27 v40.26,7.87 | 94.87,16.53 94.38,16.53 v94.36,16.51 94.85,16.51 94.87,16.53 | 94.87,16.53 N8.7
  Bottom 0.254: v97.16,18.54 97.16,18.86 97.69,19.4
DIGITS8  (via drill 0.38)
  Top 0.203: v91.57,11.18 91.95,10.79 91.95,9.27 89.41,6.73 68.33,6.73 66.93,8.13 66.67,8.13 | 66.67,8.13 64.26,8.13 62.87,6.73 52.32,6.73 50.55,8.51 41.27,8.51 41.02,8.26 v41.15,8.13 41.15,7.87 40.39,7.11 39.5,7.11 38.99,6.6 17.53,6.6 v17.27,6.35 | v66.42,11.56 62.37,11.56 N6.8 | N9.8 118.49,15.48 118.49,18.03 117.35,19.18 115.06,19.18 114.3,19.94 111.25,19.94 110.62,19.3 110.62,18.67 108.46,16.51 v108.46,16.13 | v3.17,17.65 3.17,17.27 3.43,17.02 3.43,13.97 3.81,13.59 3.81,12.83 v3.68,12.83 | 66.67,8.13 v66.42,7.87
  Bottom 0.203: N5.8 38.99,11.55 39.5,11.05 39.5,10.79 41.15,9.14 v41.15,8.13 | N7.8 83.52,11.43 91.31,11.43 v91.57,11.18 91.69,11.3 95.38,11.3 | N4.8 17.31,6.57 v17.27,6.35 17.02,6.1 12.19,6.1 11.68,5.59 10.79,5.59 10.41,5.97 6.99,5.97 5.84,7.11 5.84,7.87 6.22,8.26 6.22,12.06 5.46,12.83 v3.68,12.83 | 66.42,7.75 v66.42,7.87 v66.42,11.56 | N8.8 104.01,14.98 104.01,15.88 104.9,16.76 106.93,16.76 107.06,16.89 107.57,16.89 108.39,16.07 v108.46,16.13 | SV1.11 2.16,21.97 3.43,20.7 3.43,17.91 v3.17,17.65
  Bottom 0.254: 104.13,14.85 N8.8 103.13,14.1 103.12,14.1 102.36,13.34 102.36,12.7 101.85,12.19 98.55,12.19 98.04,12.7 97.66,12.7 97.28,12.45 96.5,11.77 96.08,11.56 96.27,11.56 95.83,11.43 | 95.38,11.3 95.83,11.43 | 95.83,11.43
DIGITS9  (via drill 0.38)
  Top 0.203: v90.68,12.45 90.93,12.19 91.82,12.19 92.33,11.68 92.33,9.02 89.66,6.35 67.94,6.35 67.06,7.24 | 67.06,7.24 v67.06,7.11 | 67.06,7.24 64.01,7.24 63.12,6.35 52.07,6.35 50.29,8.13 42.04,8.13 40.39,6.48 v40.13,6.48 39.62,6.48 39.37,6.22 19.81,6.22 v19.56,5.97 | v67.06,10.79 67.06,11.81 66.67,12.19 65.15,12.19 63.27,14.07 N6.9
  Bottom 0.203: v90.68,12.45 90.68,11.94 | 85.72,11.94 85.72,12.62 N7.9 | 18.3,13.97 N4.9 19.56,12.67 v19.56,5.97 19.3,5.71 12.45,5.71 11.94,5.21 10.54,5.21 10.16,5.59 6.73,5.59 5.46,6.86 5.46,8.13 5.59,8.26 5.59,10.03 4.57,11.05 SV1.4 | 93.5,11.94 93.51,11.94 93.89,12.32 | v40.13,6.48 41.02,7.37 41.27,7.37 41.78,7.87 41.78,9.14 40.77,10.16 40.77,12.92 N5.9 | 103.27,16.53 103.53,16.53 105.28,18.29 109.09,18.29 109.22,18.16 | 111.82,15.49 111.82,15.43 111.63,15.24 111.12,15.24 110.24,15.62 110.15,15.62 109.73,16.04 | v67.06,7.11 v67.06,10.79
  Bottom 0.254: 109.58,16.15 109.73,16.04 109.6,16.17 109.6,17.78 109.22,18.16 | N8.9 102.91,16.19 99.82,16.19 97.66,14.03 97.22,14.03 95.63,13.91 95.44,13.91 93.47,11.94 | N9.9 114.91,16.36 114.81,16.26 113.67,16.26 113.41,16 113.28,16 113.03,15.75 112.08,15.75 111.82,15.49 | N7.9 84.5,13.8 | 85.72,11.94 90.68,11.94 93.47,11.94 | 93.47,11.94 93.5,11.94 93.82,12.25
  Bottom 0.406: N8.9 103.27,16.53
GND  (via drill 0.38, 0.5 pad 0.81, 0.6 pad 1.02)  (15 unrouted)
  Top 0.254: U$1.2 88.77,26.54 89.66,25.78 92.08,25.78 92.58,26.29 v94.36,26.29 109.35,26.29 v109.6,26.54 | X2.4 61.42,39.96 | BAT1.- 118.24,34.29 117.47,33.53 115.7,33.53 115.44,33.78 113.79,33.78 | v109.35,36.83 110.24,37.97 | 106.68,34.67 108.2,33.15 109.22,33.15 | v80.77,39.24 81.15,38.99 81.15,34.8 81.79,34.16 81.79,32.77 81.03,32 79.25,32 78.61,32.77 | IC7.1 109.86,44.45 109.22,43.81 | v69.98,35.81 69.98,40.01 72.52,42.55 72.52,43.18 v73.03,43.69 | SV7.3 84.33,46.23 v83.19,45.59 | v85.22,44.83 83.95,44.83 v83.19,45.59 | v83.19,45.59 83.19,45.47 | U$3.1X 96.77,48.01 98.93,45.85 98.93,44.83 U$3.2A
  Top 0.813: C24.2 59.05,34.29 v58.8,34.04 59.18,34.04 61.09,32.13 64.77,32.13 65.28,32.64 66.8,32.64 v69.98,35.81 | 124.59,43.69 124.59,43.81 124.46,43.94 124.46,46.74 SV5.12
  Top 1.016: X2.4 60.83,39.96 60.07,39.2 60.07,35.94 58.8,34.67 v58.8,34.04 | v73.15,32.77 78.61,32.77 | SV5.8 125.35,42.93 124.59,43.69
  Top 1.422: J2.1 J2.2
  Top 1.778: J2.1 41.16,41.77 44.83,38.1 44.83,37.08 C6.-
  Bottom 0.203: T22.E 120.19,43.23 121.09,44.13 | 88.27,48.51 88.65,49.28 | 95.02,34.96 95.09,34.96 95.5,34.54 | IC1.35 87.79,32.17 87.25,31.62 86.45,31.62 C20.2
  Bottom 0.254: IC3.15 109.35,28.53 | v109.35,36.83 109.47,36.83 | U$2.4 59.44,36.45 58.93,35.94 58.93,34.29 58.8,34.16 v58.8,34.04 58.93,33.91 58.93,33.15 59.44,32.64 U$2.1 | 109.35,30.35 113.03,34.04 113.79,33.78 114.3,33.27 114.3,31.75 116.25,29.8 T21.E | 109.22,33.15 109.73,33.15 | 110.11,45.47 110.74,44.83 IC7.1 112.39,46.1 114.68,46.1 115.19,46.61 SV4.10 | C15.2 110.11,45.47 | 110.11,45.47 110.74,45.47 | 88.27,48.51 88.01,49.02 87.44,49.02 C3.2 87.31,48.58 87.38,49.02 84.2,49.02 83.19,48.01 v83.19,45.59 | 73.6,45.91 74.8,47.12 79.06,47.75 C2.2 | v73.03,43.69 73.03,44.58 73.53,45.09 | 88.65,49.28 91.95,49.28 92.84,48.51 | 93.22,46.61 94.74,46.61 96.14,48.01 U$3.1X | v85.22,44.83 85.22,43.18 85.47,42.93 | 90.68,43.05 90.81,42.93 90.81,41.4 90.79,41.39 IC1.8 | IC4.6 29.46,36.33 31.16,36.33 R4.2
  Bottom 0.305: 41.27,30.1 C5.2 | C22.2 35.43,30.23 | C21.2 80.9,40.71 81.03,40.01 v80.77,39.24 81.32,39.46 IC1.47 87.16,39.46 87.63,38.99 | 87.63,38.99 87.63,34.42 87.76,34.29 87.8,34.19 IC1.35 | 87.63,38.99 v89.92,38.35 | v89.92,38.35 90.81,40.01 90.81,41.3 IC1.8 | v89.92,38.35 92.32,36.46 92.46,36.46 92.46,35.18 92.67,34.96 IC1.23 95.02,34.96 | IC12.2 53.98,39.27 IC12.3 | v109.6,26.54 109.6,26.67 109.35,26.92 109.35,28.34 IC3.15 | C2.2 83.5,47.56
  Bottom 0.406: 14.35,39.12 13.46,39.37 | IC8.7 IC8.6 29.59,46.19 IC8.3 IC8.2 26.67,44.96 28.07,44.96 28.7,44.32 29.46,42.16 28.96,41.66 | C7.2 13.9,39.44 14.35,39.12 | SV5.12 125.73,47.75 124.84,46.86 122.3,46.86 121.28,45.85 121.28,44.32 121.09,44.13 | 14.35,39.12 19.3,39.12 19.56,38.86 R6.1 | 95.5,34.54 95.63,34.54 96.01,34.16 C25.2 R50.2 | C36.2 v94.36,26.29
  Bottom 0.61: 27.42,35.06 IC4.7 | 28.96,41.66 27.69,41.66 27.18,41.15 | C29.2 50.42,35.18 50.55,35.31 50.93,35.69 52.45,35.69 | 52.45,35.69 53.21,34.92 IC12.7 | 52.45,35.69 52.7,35.69 53.47,36.45 53.47,39.01 | 53.47,39.01 53.47,39.24 53.21,39.24 | 53.47,39.01 IC12.2 | C28.2 54.83,37.12 53.98,37.97 53.98,39.27
  Bottom 0.813: Q9.2 72.88,35.81 v69.98,35.81 69.98,33.78 69.34,33.14 C35.2 | 19.56,38.86 22.16,38.86 C1.2 22.86,40.13 23.88,41.15 27.18,41.15 | IC4.7 28.43,35.3 29.46,36.33 | C28.2 57.15,35.69 v58.8,34.04 | IC2.12 10.79,40.39 11.68,39.5 13.8,39.5 C7.2 | C20.2 C92.2
  Bottom 1.016: C17.2 28.57,41.4 28.7,44.32 | v73.15,32.77 70.99,32.77 69.98,33.78 | C34.- 48.55,37.3 50.55,35.31
  Bottom 1.27: 33.27,36.42 R4.2 31.5,37.29 C16.2 | v30.35,43.56 30.35,45.43 29.59,46.19 | C6.- 45.43,37.5 43.94,38.99 41.27,38.99 41.15,38.86 | C54.- 41.53,29.72 41.02,30.23
  Bottom 1.676: 33.27,36.42 33.27,36.58 33.27,37.59 34.54,38.86 41.15,38.86
  Bottom 1.778: C22.2 35.31,34.54 33.27,36.58 | 41.27,30.1 41.15,30.23 41.02,30.23 35.43,30.23 | C34.- 46.25,37.3 C6.-
  other vias: 87.5,39.75 87.5,36.83 92.58,39.37 87.5,38.23 92.08,35.94 89.92,36.96 92.58,37.72 89.92,39.75 53.85,36.2 50.42,37.34 50.42,35.43 52.07,36.2 55.75,36.2 56.77,32.64 60.71,39.62 60.71,38.61 59.69,39.62 58.42,37.21 57.28,35.81 115.32,37.21 73.79,48.9 72.01,48.9 72.01,47.24 73.66,47.24 73.66,45.59 71.88,45.59 77.72,49.02 65.41,47.88 65.41,49.28 69.98,33.66 68.45,33.15 62.48,32.51 98.17,40.51 97.54,41.02 98.81,41.15 97.79,29.46 97.03,30.73 100.2,31.88 101.09,29.72 103.12,30.86 102.36,34.29 106.17,34.16 104.52,32.51 111.63,33.15 111.12,30.35 107.95,31.62 105.92,30.35 114.94,32 113.92,30.23 113.54,33.78 115.19,33.78 117.09,42.04 104.52,41.53 109.86,41.15 113.41,42.42 115.82,40.89 105.41,45.21 104.14,43.69
  pour Bottom (isolate 0.305, no thermals): 28.96,42.55 33.02,42.55 33.53,42.04 33.53,40.51 35.05,38.99 35.05,38.73 33.02,36.7 27.81,36.7 26.92,37.59 26.92,40.39 26.8,40.51 26.8,40.89 28.32,42.42
  pour Bottom (isolate 0.254): 101.98,37.47 115.19,37.47 115.7,36.96 115.7,29.72 114.55,28.57 102.62,28.57 101.73,29.46 101.73,36.83 102.11,37.21
  pour Top (isolate 0.254): 101.35,42.16 95.63,41.66 95.12,41.02 91.82,41.02 90.68,42.16 86.11,42.16 85.34,41.4 85.34,40.39 85.09,40.13 85.09,33.15 85.6,32.64 92.33,32.64 95.25,35.56 95.25,37.97 101.09,39.88
  pour Bottom (isolate 0.254): 93.85,40.26 93.73,40.26 93.22,40.77 86.61,40.77 86.23,40.39 86.23,34.92 85.85,34.54 85.6,34.54 84.2,33.15 84.2,31.62 84.96,30.86 93.47,30.86 94.61,32
  pour Top (isolate 0.254): 94.36,33.66 99.95,34.54 100.46,35.05 114.94,35.05 116.84,33.15 116.84,28.7 115.06,26.92 101.35,26.92 94.23,28.19
  pour Top (isolate 0.254): 109.09,36.2 115.7,36.07 116.84,37.21 117.6,37.21 118.24,37.85 118.24,43.31 116.08,43.31 115.57,42.8 113.67,42.8 111.76,45.21 109.6,45.21 108.58,45.72 104.27,45.72 102.74,44.2 102.74,40.51 101.85,39.62 101.85,37.59 102.23,37.21
  pour Top (isolate 0.254): 85.98,49.02 82.93,49.02 81.66,47.75 81.66,44.7 82.3,44.07 85.85,44.07 86.49,44.7 86.49,47.12 86.36,47.24
  pour Bottom (isolate 0.254): 52.96,49.78 127.51,49.53 127.89,25.4 93.09,25.4 93.47,32.26 94.11,40.51 81.53,40.51 81.41,38.61 75.31,39.5 73.15,35.18 52.58,33.15
  pour Bottom (isolate 0.254): 50.55,41.78 62.36,41.78 63.37,40.77 63.37,32.64 61.85,31.11 49.28,31.11 48.39,32 48.39,37.97 48.64,38.23
  pour Top (isolate 0.254): 38.61,42.42 38.61,49.66 87.12,49.91 87.63,25.27 43.43,25.27 43.31,37.85
GND1  (via drill 0.38, 0.6)